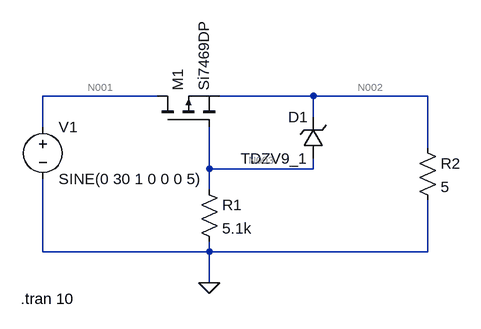
[diagram p0: schematic ProtectionCircuit_Simulation.asc]
ProtectionCircuit_Simulation.asc, the LTspice schematic file:
Version 4
SHEET 1 880 680
WIRE 176 128 0 128
WIRE 416 128 272 128
WIRE 592 128 416 128
WIRE 416 160 416 128
WIRE 0 176 0 128
WIRE 592 208 592 128
WIRE 256 240 256 176
WIRE 416 240 416 224
WIRE 416 240 256 240
WIRE 256 272 256 240
WIRE 0 368 0 256
WIRE 256 368 256 352
WIRE 256 368 0 368
WIRE 592 368 592 288
WIRE 592 368 256 368
WIRE 256 416 256 368
FLAG 256 416 0
SYMBOL pmos 176 176 R270
SYMATTR InstName M1
SYMATTR Value Si7469DP
SYMBOL voltage 0 160 R0
WINDOW 123 0 0 Left 0
WINDOW 39 0 0 Left 0
SYMATTR InstName V1
SYMATTR Value SINE(0 30 1 0 0 0 5)
SYMBOL zener 432 224 R180
WINDOW 0 24 64 Left 2
WINDOW 3 24 0 Left 2
SYMATTR InstName D1
SYMATTR Value TDZV9_1
SYMBOL res 240 256 R0
SYMATTR InstName R1
SYMATTR Value 5.1k
SYMBOL res 576 192 R0
SYMATTR InstName R2
SYMATTR Value 5
TEXT -34 440 Left 2 !.tran 10

The netlist it stands for:
* ProtectionCircuit_Simulation.asc
M1 N001 N003 N002 N002 Si7469DP
V1 N001 0 SINE(0 30 1 0 0 0 5)
D1 N003 N002 TDZV9_1
R1 N003 0 5.1k
R2 N002 0 5
.model D D
.lib standard.dio
.model NMOS NMOS
.model PMOS PMOS
.lib standard.mos
.tran 10
.backanno
.end

* Results of the author's LTspice run, read from the files saved beside the schematic
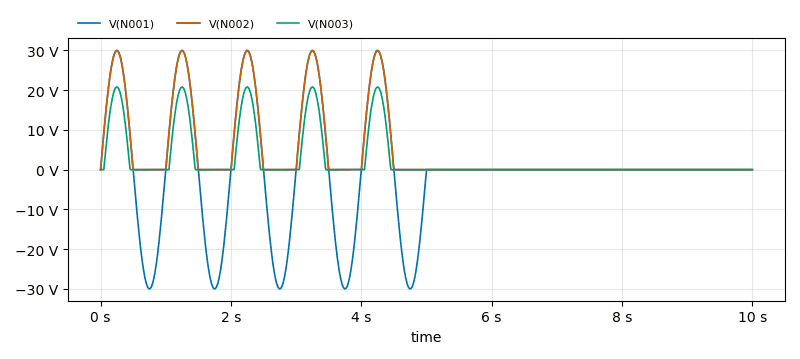
[diagram p1: Transient Analysis of ProtectionCircuit_Simulation.asc, plotted from the saved traces]
* Transient Analysis, 1 run:
*   V(N001): min -29.96 V, max 29.99 V, average 4.341 mV, rms 15 V, last 0 V
*   V(N002): min 0 V, max 29.87 V, average 4.747 V, rms 10.56 V, last 0 V
*   V(N003): min -46.49 mV, max 20.77 V, average 2.704 V, rms 6.665 V, last 0 V